# EAGLE design Top (EAGLE 9.0.0)
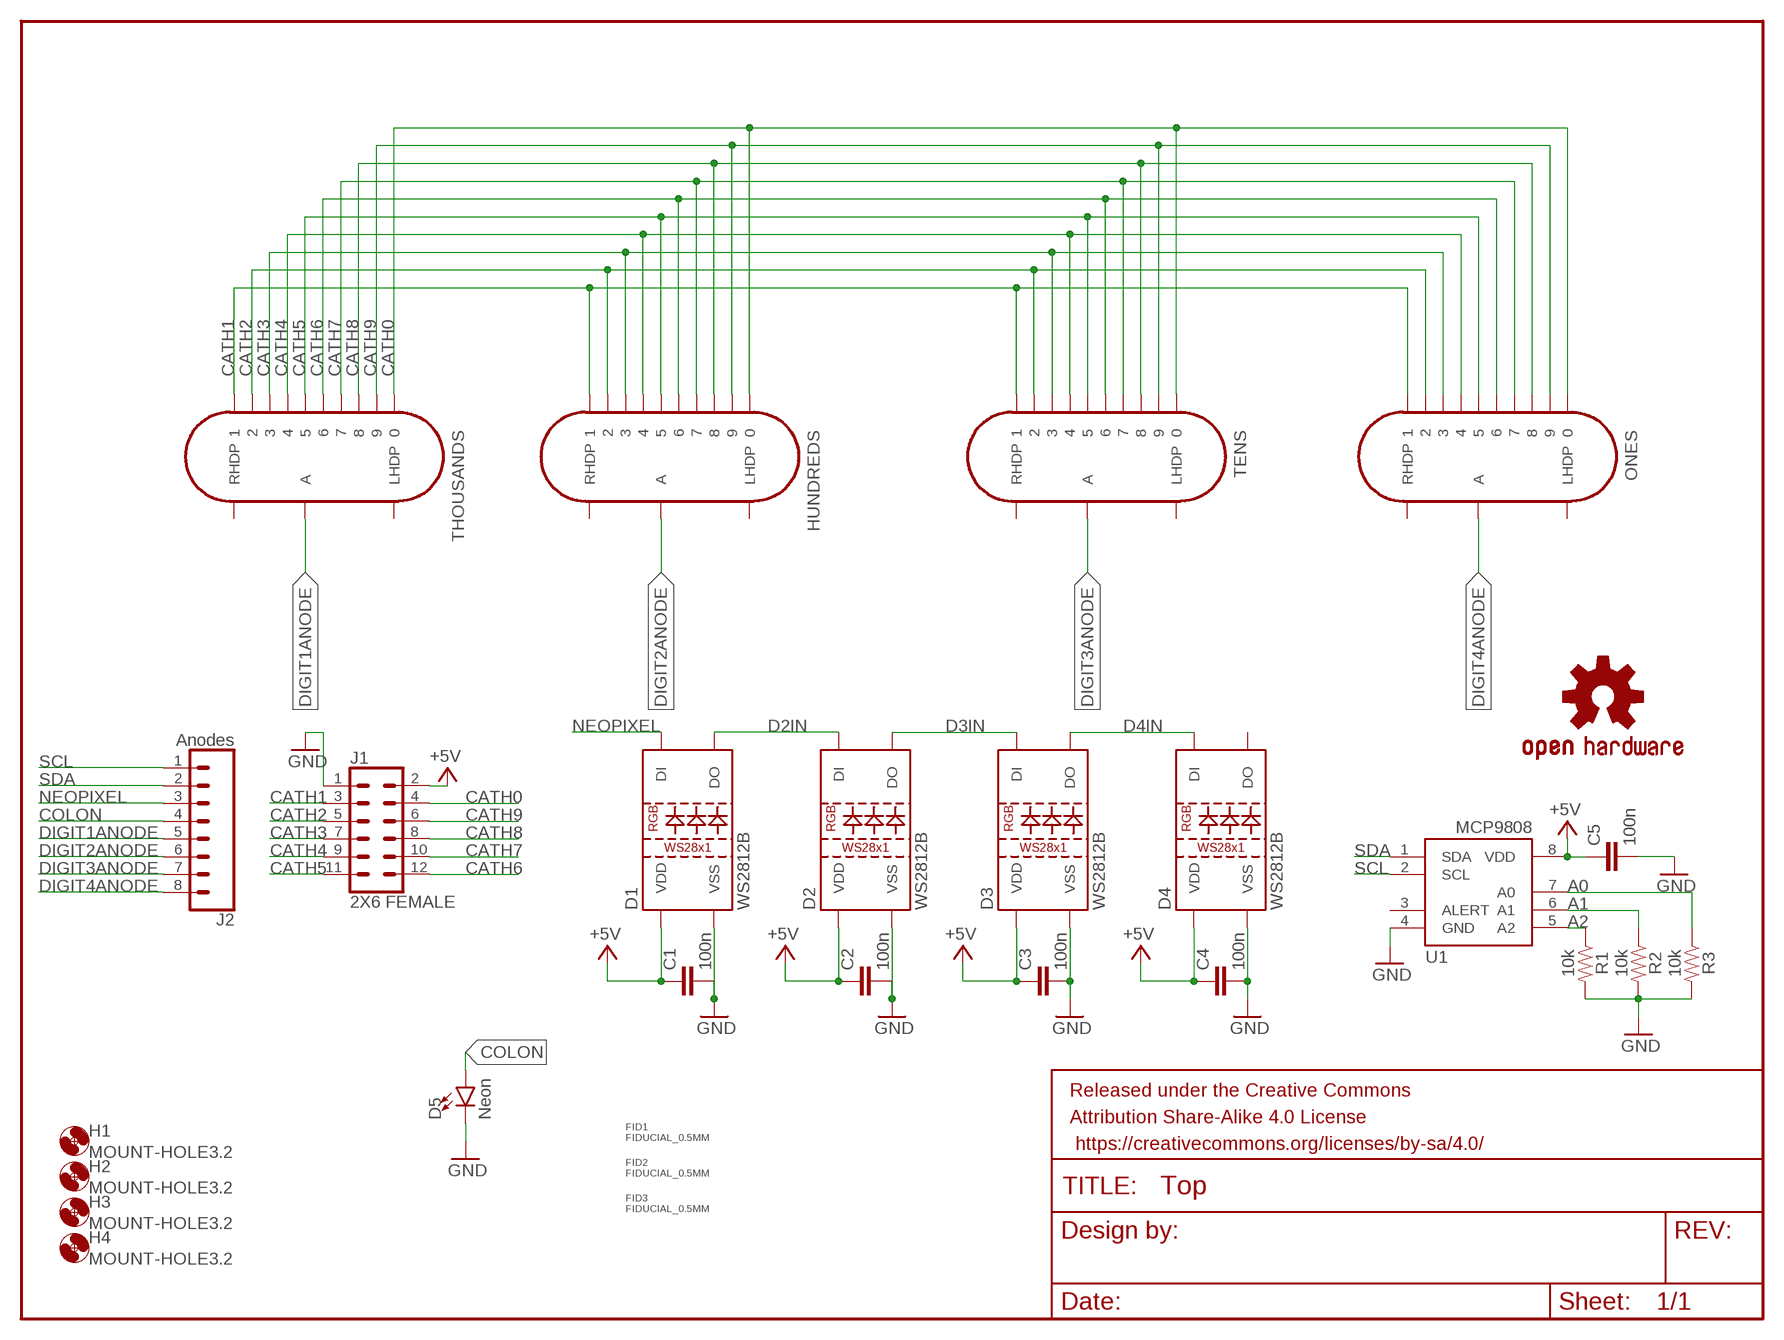
[diagram p0: schematic, sheet 1]

## Parts
C1  100n  2.2UF-0805-25V-(+80/-20%)  [0805]
C2  100n  2.2UF-0805-25V-(+80/-20%)  [0805]
C3  100n  2.2UF-0805-25V-(+80/-20%)  [0805]
C4  100n  2.2UF-0805-25V-(+80/-20%)  [0805]
C5  100n  2.2UF-0805-25V-(+80/-20%)  [0805]
D1  WS2812B  [WS2812B]
D2  WS2812B  [WS2812B]
D3  WS2812B  [WS2812B]
D4  WS2812B  [WS2812B]
D5  Neon  LED5MM  [LED_5MM]
FID1  FIDUCIAL_0.5MM  [FIDUCIAL_0.5MM]
FID2  FIDUCIAL_0.5MM  [FIDUCIAL_0.5MM]
FID3  FIDUCIAL_0.5MM  [FIDUCIAL_0.5MM]
FRAME1  FRAME-LETTER  [CREATIVE_COMMONS]
H1  MOUNT-HOLE3.2  [3,2]
H2  MOUNT-HOLE3.2  [3,2]
H3  MOUNT-HOLE3.2  [3,2]
H4  MOUNT-HOLE3.2  [3,2]
HUNDREDS  IN-14  [IN-14]
J1  2X6 FEMALE  CONN_06X2NO_SILK  [2X6_NOSILK]
J2  Anodes  CONN_08NO_SILK_FEMALE_PTH  [1X08_NO_SILK]
LOGO1  OSHW-LOGOM  [OSHW-LOGO-M]
ONES  IN-14  [IN-14]
R1  10k  0.75OHM-0805-1/4W-1%  [0805]
R2  10k  0.75OHM-0805-1/4W-1%  [0805]
R3  10k  0.75OHM-0805-1/4W-1%  [0805]
TENS  IN-14  [IN-14]
THOUSANDS  IN-14  [IN-14]
U1  MCP9808-E/MS  [MSOP8_0.65MM]

## Nets
+5V [5V]: C1.1 C2.1 C3.1 C4.1 C5.1 D1.1(VDD) D2.1(VDD) D3.1(VDD) D4.1(VDD) J1.2 U1.8(VDD)
A0: R3.1 U1.7(A0)
A1: R2.1 U1.6(A1)
A2: R1.1 U1.5(A2)
CATH0 [NixieWires]: HUNDREDS.1 J1.4 ONES.1 TENS.1 THOUSANDS.1
CATH1 [NixieWires]: HUNDREDS.0 J1.3 ONES.0 TENS.0 THOUSANDS.0
CATH2 [NixieWires]: HUNDREDS.9 J1.5 ONES.9 TENS.9 THOUSANDS.9
CATH3 [NixieWires]: HUNDREDS.8 J1.7 ONES.8 TENS.8 THOUSANDS.8
CATH4: HUNDREDS.7 J1.9 ONES.7 TENS.7 THOUSANDS.7
CATH5 [NixieWires]: HUNDREDS.6 J1.11 ONES.6 TENS.6 THOUSANDS.6
CATH6 [NixieWires]: HUNDREDS.5 J1.12 ONES.5 TENS.5 THOUSANDS.5
CATH7 [NixieWires]: HUNDREDS.4 J1.10 ONES.4 TENS.4 THOUSANDS.4
CATH8 [NixieWires]: HUNDREDS.3 J1.8 ONES.3 TENS.3 THOUSANDS.3
CATH9 [NixieWires]: HUNDREDS.2 J1.6 ONES.2 TENS.2 THOUSANDS.2
COLON [NixieWires]: D5.A J2.4
D2IN: D1.2(DO) D2.4(DI)
D3IN: D2.2(DO) D3.4(DI)
D4IN: D3.2(DO) D4.4(DI)
DIGIT1ANODE [NixieWires]: J2.5 THOUSANDS.A
DIGIT2ANODE [NixieWires]: HUNDREDS.A J2.6
DIGIT3ANODE [NixieWires]: J2.7 TENS.A
DIGIT4ANODE [NixieWires]: J2.8 ONES.A
GND: C1.2 C2.2 C3.2 C4.2 C5.2 D1.3(VSS) D2.3(VSS) D3.3(VSS) D4.3(VSS) D5.K(C) J1.1 R1.2 R2.2 R3.2 U1.4(GND)
NEOPIXEL: D1.4(DI) J2.3
SCL: J2.1 U1.2(SCL)
SDA: J2.2 U1.1(SDA)
Unconnected: D4.2(DO) HUNDREDS.LHDP HUNDREDS.RHDP ONES.LHDP ONES.RHDP TENS.LHDP TENS.RHDP THOUSANDS.LHDP THOUSANDS.RHDP U1.3(ALERT)

## Library data of the parts
C1-C5 = SparkFun-Capacitors:2.2UF: 2.2µF ceramic capacitors A capacitor is a passive two-terminal electrical component used to store electrical energy temporarily in an electric field.; PROD_ID: CAP-11624; VALUE: 2.2uF
D1-D4 = SparkFun-LED:WS2812B: WS2812B SMD addressable RGB LED 5x5mm SMD LED with built-in controller IC. Color: Red/Green/Blue mC Rating: RGB: 390, 660, 180 mcd Forward Voltage: RGB: 2.0, 3.0, 3.0 V Packages:WS2812B SparkFun Products: Blynk Board - ESP8266 <https://www.sparkfun.com/products/13794>; PROD_ID: DIO-12503
D5 = SparkFun-LED:LED: LED (Generic) Standard schematic elements and footprints for 5mm, 3mm, 1206, and 0603 sized LEDs. Generic LEDs with no color specified.
FID1-FID3 = MF_Aesthetics:FIDUCIAL: Library: MF_Aesthetics Description: Fiducial marking for PCB alignment inside PNP and other machines.; HOUSEPART: NO; POPULATE: 0
FRAME1 = SparkFun-Aesthetics:FRAME-LETTER: Schematic Frame - Letter Standard 8.5x11 US Letter frame
H1-H4 = holes:MOUNT-HOLE: MOUNTING HOLE with drill center marker
HUNDREDS ONES TENS THOUSANDS = russian-nixies:IN-14: IN-14: medium numeric frontview nixie tube
J1 = SparkFun-Connectors:CONN_06X2: Multi connection point. Often used as Generic Header-pin footprint for 0.1 inch spaced/style header connections On any of the 0.1 inch spaced packages, you can populate with these: Break Away Headers - Straight <https://www.sparkfun.com/products/116> (PRT-00116) Break Away Male Headers - Right Angle <https://www.sparkfun.com/products/553> (PRT-00553) Female Headers <https://www.sparkfun.com/products/115> (PRT-00115) Break Away Headers - Machine Pin <https://www.sparkfun.com/products/117> (PRT-00117) Break Away Female Headers - Swiss Machine Pin <https://www.sparkfun.com/products/743> (PRT-00743)
J2 = SparkFun-Connectors:CONN_08: Multi connection point. Often used as Generic Header-pin footprint for 0.1 inch spaced/style header connections On any of the 0.1 inch spaced packages, you can populate with these: Break Away Headers - Straight <https://www.sparkfun.com/products/116> (PRT-00116) Break Away Male Headers - Right Angle <https://www.sparkfun.com/products/553> (PRT-00553) Female Headers <https://www.sparkfun.com/products/115> (PRT-00115) Break Away Headers - Machine Pin <https://www.sparkfun.com/products/117> (PRT-00117) Break Away Female Headers - Swiss Machine Pin <https://www.sparkfun.com/products/743> (PRT-00743) Arduino Stackable Header - 8 Pin <https://www.sparkfun.com/products/9279> (PRT-09279) For SCREWTERMINALS and SPRING TERMINALS visit here: Screw Terimnals on SparkFun.com <https://www.sparkfun.com/search/results?term=Screw+Terminals> (5mm/3.5mm/2.54mm spacing) This device is also useful as a general connection point to wire up your design to another part of your project. Our various solder wires solder well into these plated through hole pads. Hook-Up Wire - Assortment (Stranded, 22 AWG) <https://www.sparkfun.com/products/11375> (PRT-11375) Hook-Up Wire - Assortment (Solid Core, 22 AWG) <https://www.sparkfun.com/products/11367> (PRT-11367) View the entire wire category on our website here <https://www.sparkfun.com/categories/141> Special notes: Molex polarized connector foot print use with SKU : PRT-08231 with associated crimp pins and housings. 1MM SMD Version SKU: PRT-10208 NOTES ON THE VARIANTS LOCK and LOCK_LONGPADS... This footprint was designed to help hold the alignment of a through-hole component (i.e. 6-pin header) while soldering it into place. You may notice that each hole has been shifted either up or down by 0.005 of an inch from it's more standard position (which is a perfectly straight line). This slight alteration caused the pins (the squares in the middle) to touch the edges of the holes. Because they are alternating, it causes a "brace" to hold the component in place. 0.005 has proven to be the perfect amount of "off-center" position when using our standard breakaway headers. Although looks a little odd when you look at the bare footprint, once you have a header in there, the alteration is very hard to notice. Also,if you push a header all the way into place, it is covered up entirely on the bottom side.; PROD_ID: CONN-08438
LOGO1 = SparkFun-Aesthetics:OSHW-LOGO: Open-Source Hardware (OSHW) Logo This logo indicates the piece of hardware it is found on incorporates a OSHW license and/or adheres to the definition of open source hardware found here: http://freedomdefined.org/OSHW
R1-R3 = SparkFun-Resistors:0.75OHM: 0.75Ω resistor A resistor is a passive two-terminal electrical component that implements electrical resistance as a circuit element. Resistors act to reduce current flow, and, at the same time, act to lower voltage levels within circuits. - Wikipedia; PROD_ID: RES-08474; VALUE: 0.75
U1 = microbuilder:MCP9808

## Net classes
1 5V: width 0.3 mm, drill 0.4 mm, clearance 0.3 mm
2 NixieWires: width 0.4 mm, drill 0.4 mm, clearance 0.4 mm
3 GND: width 0.3 mm, drill 0.4 mm, clearance 0.4 mm to class 0

## Board
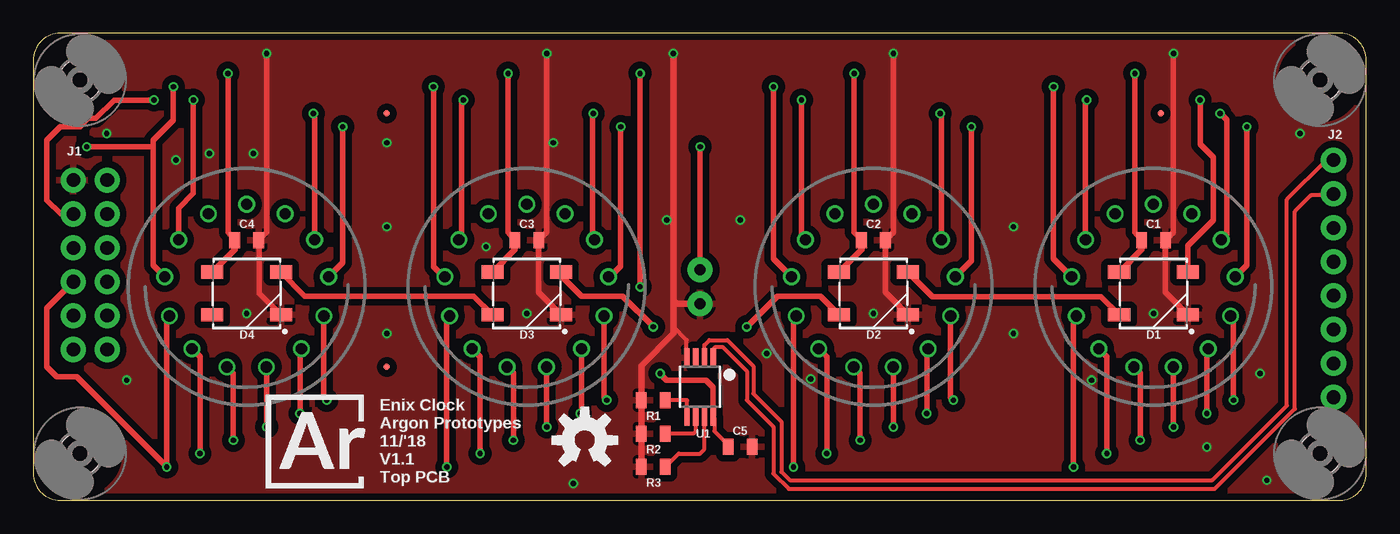
[diagram p1: board, top side]
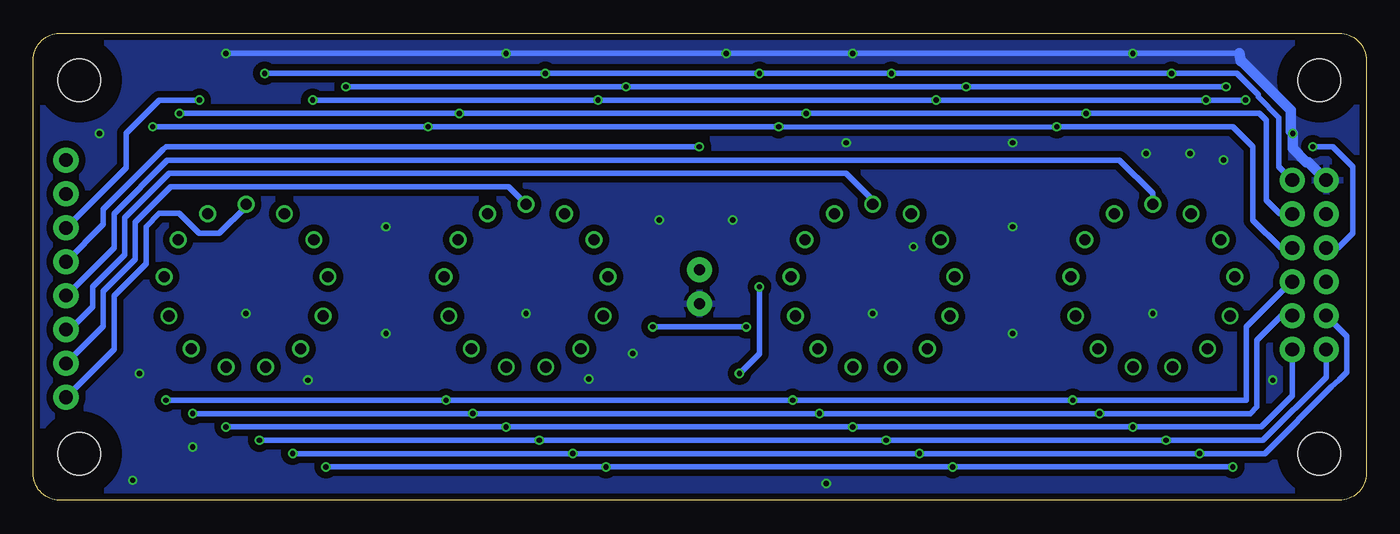
[diagram p2: board, bottom side, seen from below]

Size 99.95 x 35 mm. Coordinates in mm from the lower left corner, seen from the top.
Outline: 0,33 0,2 arc90 2,0 98,0 arc90 99.95,2 99.95,33 arc90 98,35 2,35 arc90 0,33
Copper layers (1*16): Top 0.035mm / dielectric 1.6mm / Bottom 0.035mm
Design rules "Elecrow_2-layer_PCB_Edited *": minimum track width 0.3mm, minimum drill 0.4mm, track to track 0.2mm, track to pad 0.3mm, pad to pad 6mil, via to via 8mil, smd to smd 0mil, copper to edge 20mil, drill to drill 10mil, minimum pad ring 6mil, minimum via ring 6mil, stop-mask expansion 0mil, vias tented up to drill 100mil, thermal gap 10mil

### Footprints (pad centres in the part's own frame; a part is rotated, then mirrored left to right if it is on the bottom)
0805 = smd 0.8 x 1.2: 1 -0.9,0; 2 0.9,0
WS2812B = smd 1.651 x 1: 1 2.577,-1.6; 2 2.577,1.6; 3 -2.577,1.6; 4 -2.577,-1.6
LED_5MM = drill 0.813 pad 1.88: A -1.27,0; K 1.27,0
FIDUCIAL_0.5MM = smd 0.5 x 0.5: FID 0,0
3,2 = hole 3.2: 0,0
IN-14 = drill 0.84: 0 5.094,-3.516; 1 -5.094,-3.516; 2 -6.145,-0.746; 3 -5.788,2.195; 4 -4.105,4.633; 5 -1.481,6.01; 6 1.481,6.01; 7 4.105,4.633; 8 5.788,2.195; 9 6.145,-0.746; A 0,-6.19; LHDP 2.877,-5.481; RHDP -2.877,-5.481
2X6_NOSILK = drill 1.016 pad 1.88: 1 0,0; 2 0,2.54; 3 2.54,0; 4 2.54,2.54; 5 5.08,0; 6 5.08,2.54; 7 7.62,0; 8 7.62,2.54; 9 10.16,0; 10 10.16,2.54; 11 12.7,0; 12 12.7,2.54
1X08_NO_SILK = drill 1.016 pad 1.88: 1 0,0; 2 2.54,0; 3 5.08,0; 4 7.62,0; 5 10.16,0; 6 12.7,0; 7 15.24,0; 8 17.78,0
MSOP8_0.65MM = smd 0.4 x 1.4: 1 -0.975,-2.2; 2 -0.325,-2.2; 3 0.325,-2.2; 4 0.975,-2.2; 5 0.975,2.2; 6 0.325,2.2; 7 -0.325,2.2; 8 -0.975,2.2

### Placement (x,y rotation side)
C1  84,19.5 0 top
C2  63,19.5 0 top
C3  37,19.5 0 top
C4  16,19.5 0 top
C5  53,4 0 top
D1  84,15.5 180 top
D2  63,15.5 180 top
D3  37,15.5 180 top
D4  16,15.5 180 top
D5  50,16 270 top
FID1  84.55,29 0 top
FID2  26.5,29 0 top
FID3  26.5,10 0 top
FRAME1  14.5,-7.5 0 top  (outside the outline)
H1  3.5,3.5 0 top
H2  3.5,31.5 0 top
H3  96.5,3.5 0 top
H4  96.5,31.5 0 top
HUNDREDS  37,16 180 top
J1  3,24 270 top
J2  97.5,25.5 270 top
LOGO1  41.35,4.5 0 top
ONES  84,16 180 top
R1  46.5,7.5 180 top
R2  46.5,5 180 top
R3  46.5,2.5 180 top
TENS  63,16 180 top
THOUSANDS  16,16 180 top
U1  50,8.5 180 top

### Tracks (layer width: path | path; a pad name or v marks a point on that pad's centre or on a via)
+5V  (via drill 0.4)
  Top 0.3: C5.1 52.1,4.15 51.08,5.17 51.08,6.2 U1.8
  Top 0.4: v47,9.5 47.5,9 50.45,9 50.98,8.47 U1.8 | v45.5,16 v45.5,32 | C2.1 61.55,20.1 v61.55,32 | C3.1 35.6,20.1 v35.6,32 | C4.1 14.6,20.1 v14.6,32 | C1.1 82.6,20.1 v82.6,32
  Top 0.5: C1.1 83.1,18.78 D1.1 | C2.1 62.1,18.78 D2.1 | C3.1 36.1,18.78 D3.1 | C4.1 15.1,18.78 D4.1
  Bottom 0.4: v82.6,32 v61.55,32 v45.5,32 v35.6,32 v14.6,32 9.7,32 8.1,30.39 8.1,30.23 6.55,28.68 6.55,25.01 J1.2 | v47,9.5 45.5,11 v45.5,16
A0
  Top 0.3: R3.1 48.4,3.5 50,3.5 50.33,3.83 U1.7
A1
  Top 0.3: U1.6 49.67,5.17 49.5,5 R2.1
A2
  Top 0.3: U1.5 49.02,7.47 49,7.5 R1.1
CATH0  (via drill 0.4)
  Top 0.4: THOUSANDS.1 21.09,28.91 v21,29 | HUNDREDS.1 41.94,19.67 41.94,28.81 42,28.86 v42,29 | TENS.1 68.09,28.91 v68,29 | ONES.1 89.49,19.92 89.49,28.51 v89,29
  Bottom 0.4: v89,29 v68,29 v42,29 v21,29 8,29 7.5,28.5 7.5,22.5 6.46,21.46 J1.4
CATH1  (via drill 0.4)
  Top 0.4: v32.25,30 32.11,29.86 32.11,19.72 HUNDREDS.0 | TENS.0 57.6,19.82 v57.6,30 | ONES.0 78.91,29.91 v79,30 | J1.3 2.04,21.46 1,22.5 1,27 2,28 3.5,28 4.13,28.63 4.69,28.63 6.05,30 v9.05,30 | THOUSANDS.0 10.91,21.91 12,23 v12,30
  Bottom 0.4: v9.05,30 v12,30 v32.25,30 v57.6,30 v79,30
CATH2  (via drill 0.4)
  Top 0.4: THOUSANDS.9 9,17.6 9,26.5 | HUNDREDS.9 30.75,16.75 30,17.5 v30,31 | TENS.9 55.5,18.1 v55.5,31 | ONES.9 76.5,18.1 v76.5,31 | v4,26.5 9,26.5 | 9,26.5 9,27 10.5,28.5 v10.5,31
  Bottom 0.4: v10.5,31 v30,31 v55.5,31 v76.5,31 | v4,26.5 2.5,26.5 1,25 1,20 2.08,18.92 J1.5
CATH3  (via drill 0.4)
  Top 0.4: THOUSANDS.8 10,13.59 v10,2.5 3.24,9.26 1.74,9.26 1,10 1,14.38 J1.7 | v31,2.5 31,13.59 HUNDREDS.8 | v57,2.5 57,13.59 TENS.8 | v78,2.5 78,13.59 ONES.8
  Bottom 0.4: v10,2.5 v31,2.5 v57,2.5 v78,2.5
CATH4  (via drill 0.4)
  Top 0.4: v12.5,3.5 12.5,10.76 THOUSANDS.7 | v33.5,3.5 33.5,10.76 HUNDREDS.7 | v59.5,3.5 59.5,10.76 TENS.7 | v80.5,3.5 80.5,10.76 ONES.7
  Bottom 0.4: v80.5,3.5 v59.5,3.5 v33.5,3.5 v12.5,3.5 7.61,3.5 2.61,8.5 2,9.05 1.46,9.59 1.46,12.3 J1.9
CATH5  (via drill 0.4)
  Top 0.4: v15,4.5 15,9.51 THOUSANDS.6 | v36,4.5 36,9.51 HUNDREDS.6 | v62,4.5 62,9.51 TENS.6 | v83,4.5 83,9.51 ONES.6
  Bottom 0.4: v83,4.5 v62,4.5 v36,4.5 v15,4.5 7.74,4.5 3,9.24 J1.11
CATH6  (via drill 0.4)
  Top 0.4: v17.5,5.5 17.5,9.97 THOUSANDS.5 | v38.5,5.5 38.5,9.97 HUNDREDS.5 | v64.5,5.5 64.5,9.97 TENS.5 | ONES.5 85.48,5.52 v85.5,5.5
  Bottom 0.4: v85.5,5.5 v64.5,5.5 v38.5,5.5 v17.5,5.5 7.87,5.5 5.54,7.83 J1.12
CATH7  (via drill 0.4)
  Top 0.4: v20,6.5 20,11.26 THOUSANDS.4 | HUNDREDS.4 41.1,6.61 v41,6.5 | v67,6.5 67,11.26 TENS.4 | v88,6.5 88,11.26 ONES.4
  Bottom 0.4: v88,6.5 v67,6.5 v41,6.5 v20,6.5 8.7,6.5 8.2,7 8.2,12 6.36,13.84 J1.10
CATH8  (via drill 0.4)
  Top 0.4: THOUSANDS.3 21.79,7.71 v22,7.5 | HUNDREDS.3 42.79,7.71 v43,7.5 | TENS.3 68.79,7.71 v69,7.5 | v90,7.5 90,13.59 ONES.3
  Bottom 0.4: v90,7.5 v69,7.5 v43,7.5 v22,7.5 9,7.5 9,13 5.62,16.38 J1.8
CATH9  (via drill 0.4)
  Top 0.4: v23.2,28 23.2,17.8 THOUSANDS.2 | HUNDREDS.2 43.25,16.75 44.05,17.55 v44.05,28 | TENS.2 70.35,17.95 v70.35,28 | ONES.2 91,17.6 v91,28
  Bottom 0.4: v91,28 70.4,28 v70.35,28 v44.05,28 44,28 23.25,27.95 v23.2,28 10,28 8.5,26.5 8.5,21 6.42,18.92 J1.6
COLON  (via drill 0.4)
  Top 0.4: D5.A v50,26.5
  Bottom 0.4: J2.4 94.7,20.68 94.7,21.83 90.22,26.3 90.2,26.3 90,26.5 v50,26.5
D2IN
  Top 0.4: D2.4 67.43,15.25 80.07,15.25 D1.2
D3IN  (via drill 0.4)
  Top 0.4: v46.5,13 44.2,15.3 41.1,15.3 39.58,16.82 D3.4 | v53.5,13 55.8,15.3 59.02,15.3 D2.2
  Bottom 0.4: v46.5,13 v53.5,13
D4IN
  Top 0.4: D3.2 33.02,15.3 20.35,15.3 18.58,17.07 D4.4
DIGIT1ANODE
  Bottom 0.4: J2.5 93.9,18.94 93.9,21.49 89.89,25.5 18.5,25.5 16,23 THOUSANDS.A
DIGIT2ANODE
  Bottom 0.4: J2.6 97.2,12.8 95.5,14.5 95.5,16 93.1,18.4 93.1,21.16 89.76,24.5 39,24.5 37,22.5 HUNDREDS.A
DIGIT3ANODE
  Bottom 0.4: J2.7 94.7,13.06 94.7,15.67 92.3,18.07 92.3,20.83 89.63,23.5 64.31,23.5 TENS.A
DIGIT4ANODE
  Bottom 0.4: J2.8 93.9,11.32 93.9,15.34 91.5,17.74 91.5,20.5 90.5,21.5 89,21.5 87.5,20 86,20 84,22 ONES.A
GND  (via drill 0.4)
  Top 0.3: U1.4 49,10.72 49,12 48,13
  Top 0.4: C4.2 16.95,19.55 | 16.95,19.55 17.5,20.1 v17.5,33.5 | v38.5,33.5 38.5,20.1 C3.2 37.9,15.58 D3.3 | v64.5,33.5 64.5,20.1 C2.2 63.9,15.58 D2.3 | v85.5,33.5 85.5,20.1 C1.2 84.9,15.58 D1.3 | D5.K 49.27,14.73 | D4.3 16.95,15.53 16.95,19.55
  Top 0.5: R3.2 R2.2 R1.2 45.6,10.1 48,12.5 48,13 48,15 | 48,15 v48,33.5 | D5.K 48.27,14.73 48,15
  Bottom 0.4: v85.5,33.5 v64.5,33.5 v48,33.5 v38.5,33.5 v17.5,33.5 9.5,33.5
  Bottom 0.8: J1.1 4.35,25.35 4.48,25.35 5.5,26.37 v5.5,27.5 5.65,27.65 5.65,29.22 9.33,32.9 9.4,32.9 9.5,33.5
  other vias: 55,11 26.5,20.5 40.5,1.25 26.5,12.5 47.5,21 53,21 73.5,12.5 73.5,20.5 92.5,1.5 95,27.5 26.5,26.8 39,26.8 16.5,26 7,9 13.2,26 16,14 37,14 63,14 84,14 92,9.5 88,4 10.7,25.5 33.95,19 58.3,9.1 79.35,9
  pour Top (isolate 0.5): 0,35 100,35 100,0 0,0
  pour Bottom (isolate 0.5): 0,35 100,35 100,0 0,0
NEOPIXEL  (via drill 0.4)
  Top 0.4: D1.4 86.58,19.08 88.49,20.99 88.49,25.71 87.5,26.7 v87.5,30
  Bottom 0.4: J2.3 93,24.92 93,27.5 90.5,30 v87.5,30
SCL
  Top 0.3: U1.2 50.33,11.62 50.7,12 52.05,12 54,10.05 54,8 56.1,5.9 56.1,2.13 56.72,1.5 88.4,1.5 94,7.1 94,22.55 96.95,25.5 J2.1
SDA
  Top 0.3: U1.1 50.98,11.3 51.12,11.45 51.73,11.45 53.5,9.68 53.5,7.5 55.5,5.5 55.5,2 56.65,0.85 88.6,0.85 94.6,6.85 94.6,21.66 95.8,22.86 97.4,22.86 J2.2

### Text on the board
tNames: Enix Clock / Argon Prototypes / 11/'18 / V1.1 / Top PCB